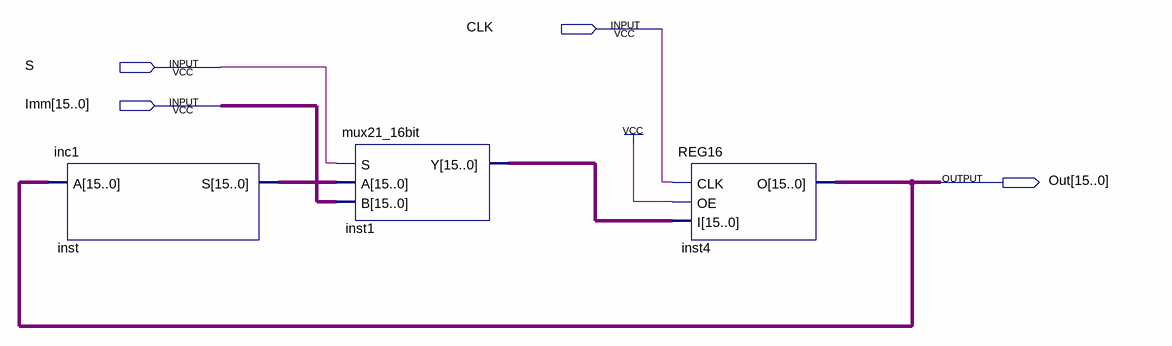
[diagram p0: schematic sheet]
// Quartus schematic program_counter.bdf as structural Verilog: 3 symbols, 4 pins
module program_counter (
  input  CLK,
  input  S,
  input  [15:0] Imm,
  output [15:0] Out
);

  wire [15:0] inst1_y, inst_s;

  inc1 inst (.A(Out), .S(inst_s));
  mux21_16bit inst1 (.S(S), .A(inst_s), .B(Imm), .Y(inst1_y));
  REG16 inst4 (.CLK(CLK), .OE(1'b1), .I(inst1_y), .O(Out));
endmodule
